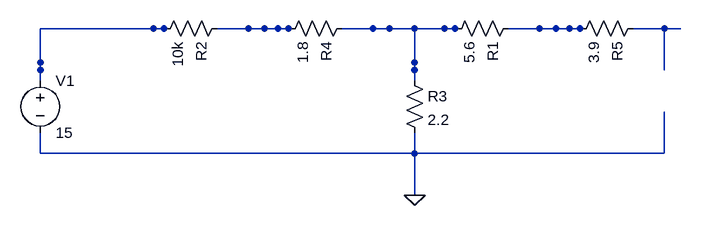
[diagram p0: schematic pannel1.asc]
pannel1.asc, the LTspice schematic file:
Version 4
SHEET 1 880 680
WIRE 464 320 537 320
WIRE 366 320 382 320
SYMBOL res 480 304 R90
SYMATTR InstName R2
SYMATTR Value 10k
WIRE 1104 320 1177 320
WIRE 1006 320 1022 320
SYMBOL res 1120 304 R90
SYMATTR InstName R5
SYMATTR Value 3.9
WIRE 656 320 729 320
WIRE 558 320 574 320
SYMBOL res 672 304 R90
SYMATTR InstName R4
SYMATTR Value 1.8
WIRE 768 400 768 372
WIRE 768 512 768 480
SYMBOL res 752 384 R0
SYMATTR InstName R3
SYMATTR Value 2.2
WIRE 912 320 985 320
WIRE 814 320 830 320
SYMBOL res 928 304 R90
SYMATTR InstName R1
SYMATTR Value 5.6
FLAG 768 576 0
WIRE 192 400 192 372
WIRE 192 512 192 480
SYMBOL voltage 192 384 R0
SYMATTR InstName V1
SYMATTR Value 15
WIRE 768 320 768 384
WIRE 704 320 768 320
WIRE 768 320 832 320
WIRE 1152 448 1152 512
WIRE 1088 512 1152 512
WIRE 768 512 832 512
WIRE 704 512 768 512
WIRE 768 512 768 576
WIRE 192 512 256 512
WIRE 192 320 192 384
WIRE 192 320 256 320
WIRE 1152 320 1152 384
WIRE 320 320 384 320
WIRE 256 320 320 320
WIRE 512 320 576 320
WIRE 960 320 1024 320
WIRE 256 512 320 512
WIRE 640 512 704 512
WIRE 576 512 640 512
WIRE 512 512 576 512
WIRE 448 512 512 512
WIRE 384 512 448 512
WIRE 320 512 384 512
WIRE 896 512 960 512
WIRE 832 512 896 512
WIRE 960 512 1024 512
WIRE 1024 512 1088 512

The netlist it stands for:
* pannel1.asc
R2 N001 N002 10k
R5 N003 N004 3.9
R4 N005 N001 1.8
R3 N005 0 2.2
R1 N004 N005 5.6
V1 N002 0 15
.backanno
.end